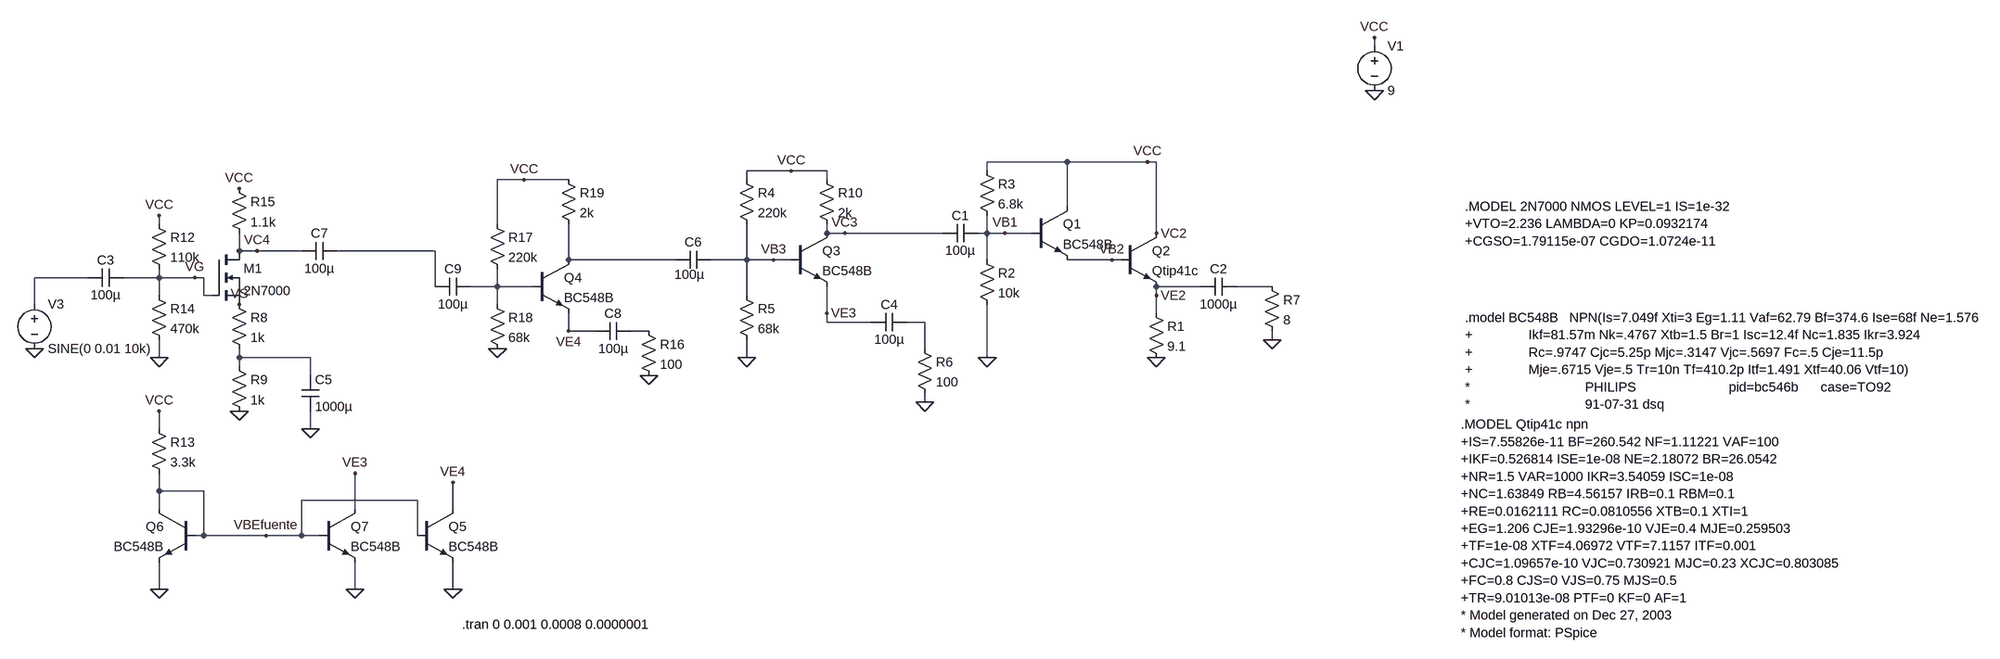
[diagram p0: schematic SegundaEtapa.asc]
SegundaEtapa.asc, the LTspice schematic file:
Version 4
SHEET 1 1936 816
WIRE 624 -240 624 -256
WIRE 32 -32 -112 -32
WIRE 176 -32 32 -32
WIRE 192 -32 176 -32
WIRE -464 -16 -544 -16
WIRE -400 -16 -464 -16
WIRE -112 -16 -112 -32
WIRE -944 0 -992 0
WIRE -864 0 -944 0
WIRE -544 0 -544 -16
WIRE -400 0 -400 -16
WIRE 32 48 32 -32
WIRE -1600 80 -1600 64
WIRE -992 80 -992 0
WIRE -400 96 -400 80
WIRE -368 96 -400 96
WIRE -192 96 -368 96
WIRE -112 96 -112 64
WIRE -112 96 -128 96
WIRE -80 96 -112 96
WIRE -32 96 -80 96
WIRE 192 96 192 -32
WIRE -1456 128 -1456 96
WIRE -1424 128 -1456 128
WIRE -1344 128 -1424 128
WIRE -1104 128 -1280 128
WIRE -864 144 -864 80
WIRE -672 144 -864 144
WIRE -544 144 -544 80
WIRE -544 144 -608 144
WIRE -496 144 -544 144
WIRE -464 144 -496 144
WIRE -112 144 -112 96
WIRE 112 144 32 144
WIRE 128 144 112 144
WIRE -1728 176 -1824 176
WIRE -1600 176 -1600 160
WIRE -1600 176 -1664 176
WIRE -1536 176 -1600 176
WIRE -1520 176 -1536 176
WIRE -1104 192 -1104 128
WIRE -992 192 -992 160
WIRE -992 192 -1040 192
WIRE -928 192 -992 192
WIRE 272 192 192 192
WIRE 400 192 336 192
WIRE -1600 208 -1600 176
WIRE -1520 208 -1520 176
WIRE -1504 208 -1520 208
WIRE -544 208 -544 144
WIRE 192 208 192 192
WIRE -1824 224 -1824 176
WIRE -992 224 -992 192
WIRE -400 240 -400 192
WIRE 192 240 192 208
WIRE -400 256 -400 240
WIRE -320 256 -400 256
WIRE -224 256 -256 256
WIRE -864 272 -864 240
WIRE -816 272 -864 272
WIRE -720 272 -752 272
WIRE 400 288 400 272
WIRE -224 304 -224 256
WIRE -1600 320 -1600 288
WIRE -1456 320 -1456 304
WIRE -1328 320 -1456 320
WIRE -544 320 -544 288
WIRE -112 320 -112 224
WIRE -1456 336 -1456 320
WIRE -1328 352 -1328 320
WIRE -224 400 -224 384
WIRE -1600 448 -1600 416
WIRE -1328 448 -1328 416
WIRE -1600 560 -1600 528
WIRE -1520 560 -1600 560
WIRE -1136 576 -1344 576
WIRE -1600 592 -1600 560
WIRE -1248 592 -1248 528
WIRE -1072 592 -1072 544
WIRE -1520 640 -1520 560
WIRE -1520 640 -1536 640
WIRE -1408 640 -1520 640
WIRE -1344 640 -1344 576
WIRE -1344 640 -1408 640
WIRE -1312 640 -1344 640
WIRE -1136 640 -1136 576
WIRE -1600 736 -1600 688
WIRE -1248 736 -1248 688
WIRE -1072 736 -1072 688
FLAG 624 -160 0
FLAG 624 -256 VCC
FLAG 176 -32 VCC
FLAG 192 320 0
FLAG -112 320 0
FLAG 112 144 VB2
FLAG -80 96 VB1
FLAG 192 208 VE2
FLAG -544 320 0
FLAG -464 -16 VCC
FLAG -496 144 VB3
FLAG 400 288 0
FLAG 192 96 VC2
FLAG -368 96 VC3
FLAG -400 240 VE3
FLAG -1600 736 0
FLAG -1600 416 VCC
FLAG -1600 64 VCC
FLAG -1600 320 0
FLAG -1456 16 VCC
FLAG -1424 128 VC4
FLAG -1248 736 0
FLAG -1248 528 VE3
FLAG -224 400 0
FLAG -1536 176 VG
FLAG -1456 224 VS
FLAG -1328 448 0
FLAG -1408 640 VBEfuente
FLAG -1824 304 0
FLAG -720 352 0
FLAG -992 304 0
FLAG -944 0 VCC
FLAG -864 272 VE4
FLAG -1072 736 0
FLAG -1072 544 VE4
FLAG -1456 416 0
SYMBOL npn 128 96 R0
SYMATTR InstName Q2
SYMATTR Value Qtip41c
SYMBOL npn -32 48 R0
SYMATTR InstName Q1
SYMATTR Value BC548B
SYMBOL voltage 624 -256 R0
WINDOW 123 0 0 Left 2
WINDOW 39 0 0 Left 2
SYMATTR InstName V1
SYMATTR Value 9
SYMBOL res 176 224 R0
SYMATTR InstName R1
SYMATTR Value 9.1
SYMBOL res -128 128 R0
SYMATTR InstName R2
SYMATTR Value 10k
SYMBOL res -128 -32 R0
SYMATTR InstName R3
SYMATTR Value 6.8k
SYMBOL npn -464 96 R0
SYMATTR InstName Q3
SYMATTR Value BC548B
SYMBOL res -560 -16 R0
SYMATTR InstName R4
SYMATTR Value 220k
SYMBOL res -560 192 R0
SYMATTR InstName R5
SYMATTR Value 68k
SYMBOL res 384 176 R0
SYMATTR InstName R7
SYMATTR Value 8
SYMBOL cap 272 208 R270
WINDOW 0 32 32 VTop 2
WINDOW 3 0 32 VBottom 2
SYMATTR InstName C2
SYMATTR Value 1000µ
SYMBOL cap -128 80 R90
WINDOW 0 0 32 VBottom 2
WINDOW 3 32 32 VTop 2
SYMATTR InstName C1
SYMATTR Value 100µ
SYMBOL res -416 -16 R0
SYMATTR InstName R10
SYMATTR Value 2k
SYMBOL npn -1536 592 M0
SYMATTR InstName Q6
SYMATTR Value BC548B
SYMBOL res -1616 432 R0
SYMATTR InstName R13
SYMATTR Value 3.3k
SYMBOL res -1616 64 R0
SYMATTR InstName R12
SYMATTR Value 110k
SYMBOL res -1616 192 R0
SYMATTR InstName R14
SYMATTR Value 470k
SYMBOL res -1472 0 R0
SYMATTR InstName R15
SYMATTR Value 1.1k
SYMBOL cap -1664 160 R90
WINDOW 0 0 32 VBottom 2
WINDOW 3 32 32 VTop 2
SYMATTR InstName C3
SYMATTR Value 100µ
SYMBOL npn -1312 592 R0
SYMATTR InstName Q7
SYMATTR Value BC548B
SYMBOL cap -320 272 R270
WINDOW 0 32 32 VTop 2
WINDOW 3 0 32 VBottom 2
SYMATTR InstName C4
SYMATTR Value 100µ
SYMBOL res -240 288 R0
SYMATTR InstName R6
SYMATTR Value 100
SYMBOL cap -672 160 R270
WINDOW 0 32 32 VTop 2
WINDOW 3 5 25 VBottom 2
SYMATTR InstName C6
SYMATTR Value 100µ
SYMBOL nmos -1504 128 R0
SYMATTR InstName M1
SYMATTR Value 2N7000
SYMBOL res -1472 208 R0
SYMATTR InstName R8
SYMATTR Value 1k
SYMBOL cap -1344 352 R0
SYMATTR InstName C5
SYMATTR Value 1000µ
SYMBOL voltage -1824 208 R0
WINDOW 123 0 0 Left 2
WINDOW 39 0 0 Left 2
SYMATTR InstName V3
SYMATTR Value SINE(0 0.01 10k)
SYMBOL cap -1344 144 R270
WINDOW 0 32 32 VTop 2
WINDOW 3 0 32 VBottom 2
SYMATTR InstName C7
SYMATTR Value 100µ
SYMBOL npn -928 144 R0
SYMATTR InstName Q4
SYMATTR Value BC548B
SYMBOL cap -816 288 R270
WINDOW 0 32 32 VTop 2
WINDOW 3 0 32 VBottom 2
SYMATTR InstName C8
SYMATTR Value 100µ
SYMBOL res -736 256 R0
SYMATTR InstName R16
SYMATTR Value 100
SYMBOL res -1008 64 R0
SYMATTR InstName R17
SYMATTR Value 220k
SYMBOL res -1008 208 R0
SYMATTR InstName R18
SYMATTR Value 68k
SYMBOL res -880 -16 R0
SYMATTR InstName R19
SYMATTR Value 2k
SYMBOL npn -1136 592 R0
SYMATTR InstName Q5
SYMATTR Value BC548B
SYMBOL cap -1104 208 R270
WINDOW 0 32 32 VTop 2
WINDOW 3 0 32 VBottom 2
SYMATTR InstName C9
SYMATTR Value 100µ
SYMBOL res -1472 320 R0
SYMATTR InstName R9
SYMATTR Value 1k
TEXT 864 440 Left 2 !.MODEL Qtip41c npn\n+IS=7.55826e-11 BF=260.542 NF=1.11221 VAF=100\n+IKF=0.526814 ISE=1e-08 NE=2.18072 BR=26.0542\n+NR=1.5 VAR=1000 IKR=3.54059 ISC=1e-08\n+NC=1.63849 RB=4.56157 IRB=0.1 RBM=0.1\n+RE=0.0162111 RC=0.0810556 XTB=0.1 XTI=1\n+EG=1.206 CJE=1.93296e-10 VJE=0.4 MJE=0.259503\n+TF=1e-08 XTF=4.06972 VTF=7.1157 ITF=0.001\n+CJC=1.09657e-10 VJC=0.730921 MJC=0.23 XCJC=0.803085\n+FC=0.8 CJS=0 VJS=0.75 MJS=0.5\n+TR=9.01013e-08 PTF=0 KF=0 AF=1\n* Model generated on Dec 27, 2003\n* Model format: PSpice
TEXT 872 248 Left 2 !.model BC548B   NPN(Is=7.049f Xti=3 Eg=1.11 Vaf=62.79 Bf=374.6 Ise=68f Ne=1.576\n+               Ikf=81.57m Nk=.4767 Xtb=1.5 Br=1 Isc=12.4f Nc=1.835 Ikr=3.924\n+               Rc=.9747 Cjc=5.25p Mjc=.3147 Vjc=.5697 Fc=.5 Cje=11.5p\n+               Mje=.6715 Vje=.5 Tr=10n Tf=410.2p Itf=1.491 Xtf=40.06 Vtf=10)\n*                               PHILIPS                         pid=bc546b      case=TO92\n*                               91-07-31 dsq
TEXT -1056 800 Left 2 !.tran 0 0.001 0.0008 0.0000001
TEXT 872 48 Left 2 !.MODEL 2N7000 NMOS LEVEL=1 IS=1e-32\n+VTO=2.236 LAMBDA=0 KP=0.0932174\n+CGSO=1.79115e-07 CGDO=1.0724e-11

The netlist it stands for:
* SegundaEtapa.asc
Q2 VC2 VB2 VE2 0 Qtip41c
Q1 VC2 VB1 VB2 0 BC548B
V1 VC2 0 9
R1 VE2 0 9.1
R2 VB1 0 10k
R3 VC2 VB1 6.8k
Q3 VC3 VB3 VE3 0 BC548B
R4 VC2 VB3 220k
R5 VB3 0 68k
R7 N005 0 8
C2 VE2 N005 1000µ
C1 VB1 VC3 100µ
R10 VC2 VC3 2k
Q6 VBEfuente VBEfuente 0 0 BC548B
R13 VC2 VBEfuente 3.3k
R12 VC2 VG 110k
R14 VG 0 470k
R15 VC2 VC4 1.1k
C3 VG N003 100µ
Q7 VE3 VBEfuente 0 0 BC548B
C4 VE3 N006 100µ
R6 N006 0 100
C6 N002 VB3 100µ
M1 VC4 VG VS VS 2N7000
R8 VS N008 1k
C5 N008 0 1000µ
V3 N003 0 SINE(0 0.01 10k)
C7 VC4 N001 100µ
Q4 N002 N004 VE4 0 BC548B
C8 VE4 N007 100µ
R16 N007 0 100
R17 VC2 N004 220k
R18 N004 0 68k
R19 VC2 N002 2k
Q5 VE4 VBEfuente 0 0 BC548B
C9 N001 N004 100µ
R9 N008 0 1k
.model NPN NPN
.model PNP PNP
.lib standard.bjt
.model NMOS NMOS
.model PMOS PMOS
.lib standard.mos
.MODEL Qtip41c npn
+IS=7.55826e-11 BF=260.542 NF=1.11221 VAF=100
+IKF=0.526814 ISE=1e-08 NE=2.18072 BR=26.0542
+NR=1.5 VAR=1000 IKR=3.54059 ISC=1e-08
+NC=1.63849 RB=4.56157 IRB=0.1 RBM=0.1
+RE=0.0162111 RC=0.0810556 XTB=0.1 XTI=1
+EG=1.206 CJE=1.93296e-10 VJE=0.4 MJE=0.259503
+TF=1e-08 XTF=4.06972 VTF=7.1157 ITF=0.001
+CJC=1.09657e-10 VJC=0.730921 MJC=0.23 XCJC=0.803085
+FC=0.8 CJS=0 VJS=0.75 MJS=0.5
+TR=9.01013e-08 PTF=0 KF=0 AF=1
* Model generated on Dec 27, 2003
* Model format: PSpice
.model BC548B   NPN(Is=7.049f Xti=3 Eg=1.11 Vaf=62.79 Bf=374.6 Ise=68f Ne=1.576
+               Ikf=81.57m Nk=.4767 Xtb=1.5 Br=1 Isc=12.4f Nc=1.835 Ikr=3.924
+               Rc=.9747 Cjc=5.25p Mjc=.3147 Vjc=.5697 Fc=.5 Cje=11.5p
+               Mje=.6715 Vje=.5 Tr=10n Tf=410.2p Itf=1.491 Xtf=40.06 Vtf=10)
*                               PHILIPS                         pid=bc546b      case=TO92
*                               91-07-31 dsq
.tran 0 0.001 0.0008 0.0000001
.MODEL 2N7000 NMOS LEVEL=1 IS=1e-32
+VTO=2.236 LAMBDA=0 KP=0.0932174
+CGSO=1.79115e-07 CGDO=1.0724e-11
.backanno
.end